# Altium schematic sheet icaRUSv0.2.SchDoc
size A3; SheetNumber: 1; PageSetup: Record=PageOptions|CenterHorizontal=True|CenterVertical=True|PrintScale=0.52|XCorrection=1.00|YCorrection=1.00|PrintKind=1|BorderSize=5000000|LeftOffset=0|BottomOffset=0|Orientation=2|PaperLength=1000|PaperWidth=1000|Scale=100|PaperSource=7|PrintQuality=600|MediaType=1|DitherType=10|PaperKind=A4|PrintScaleMode=1
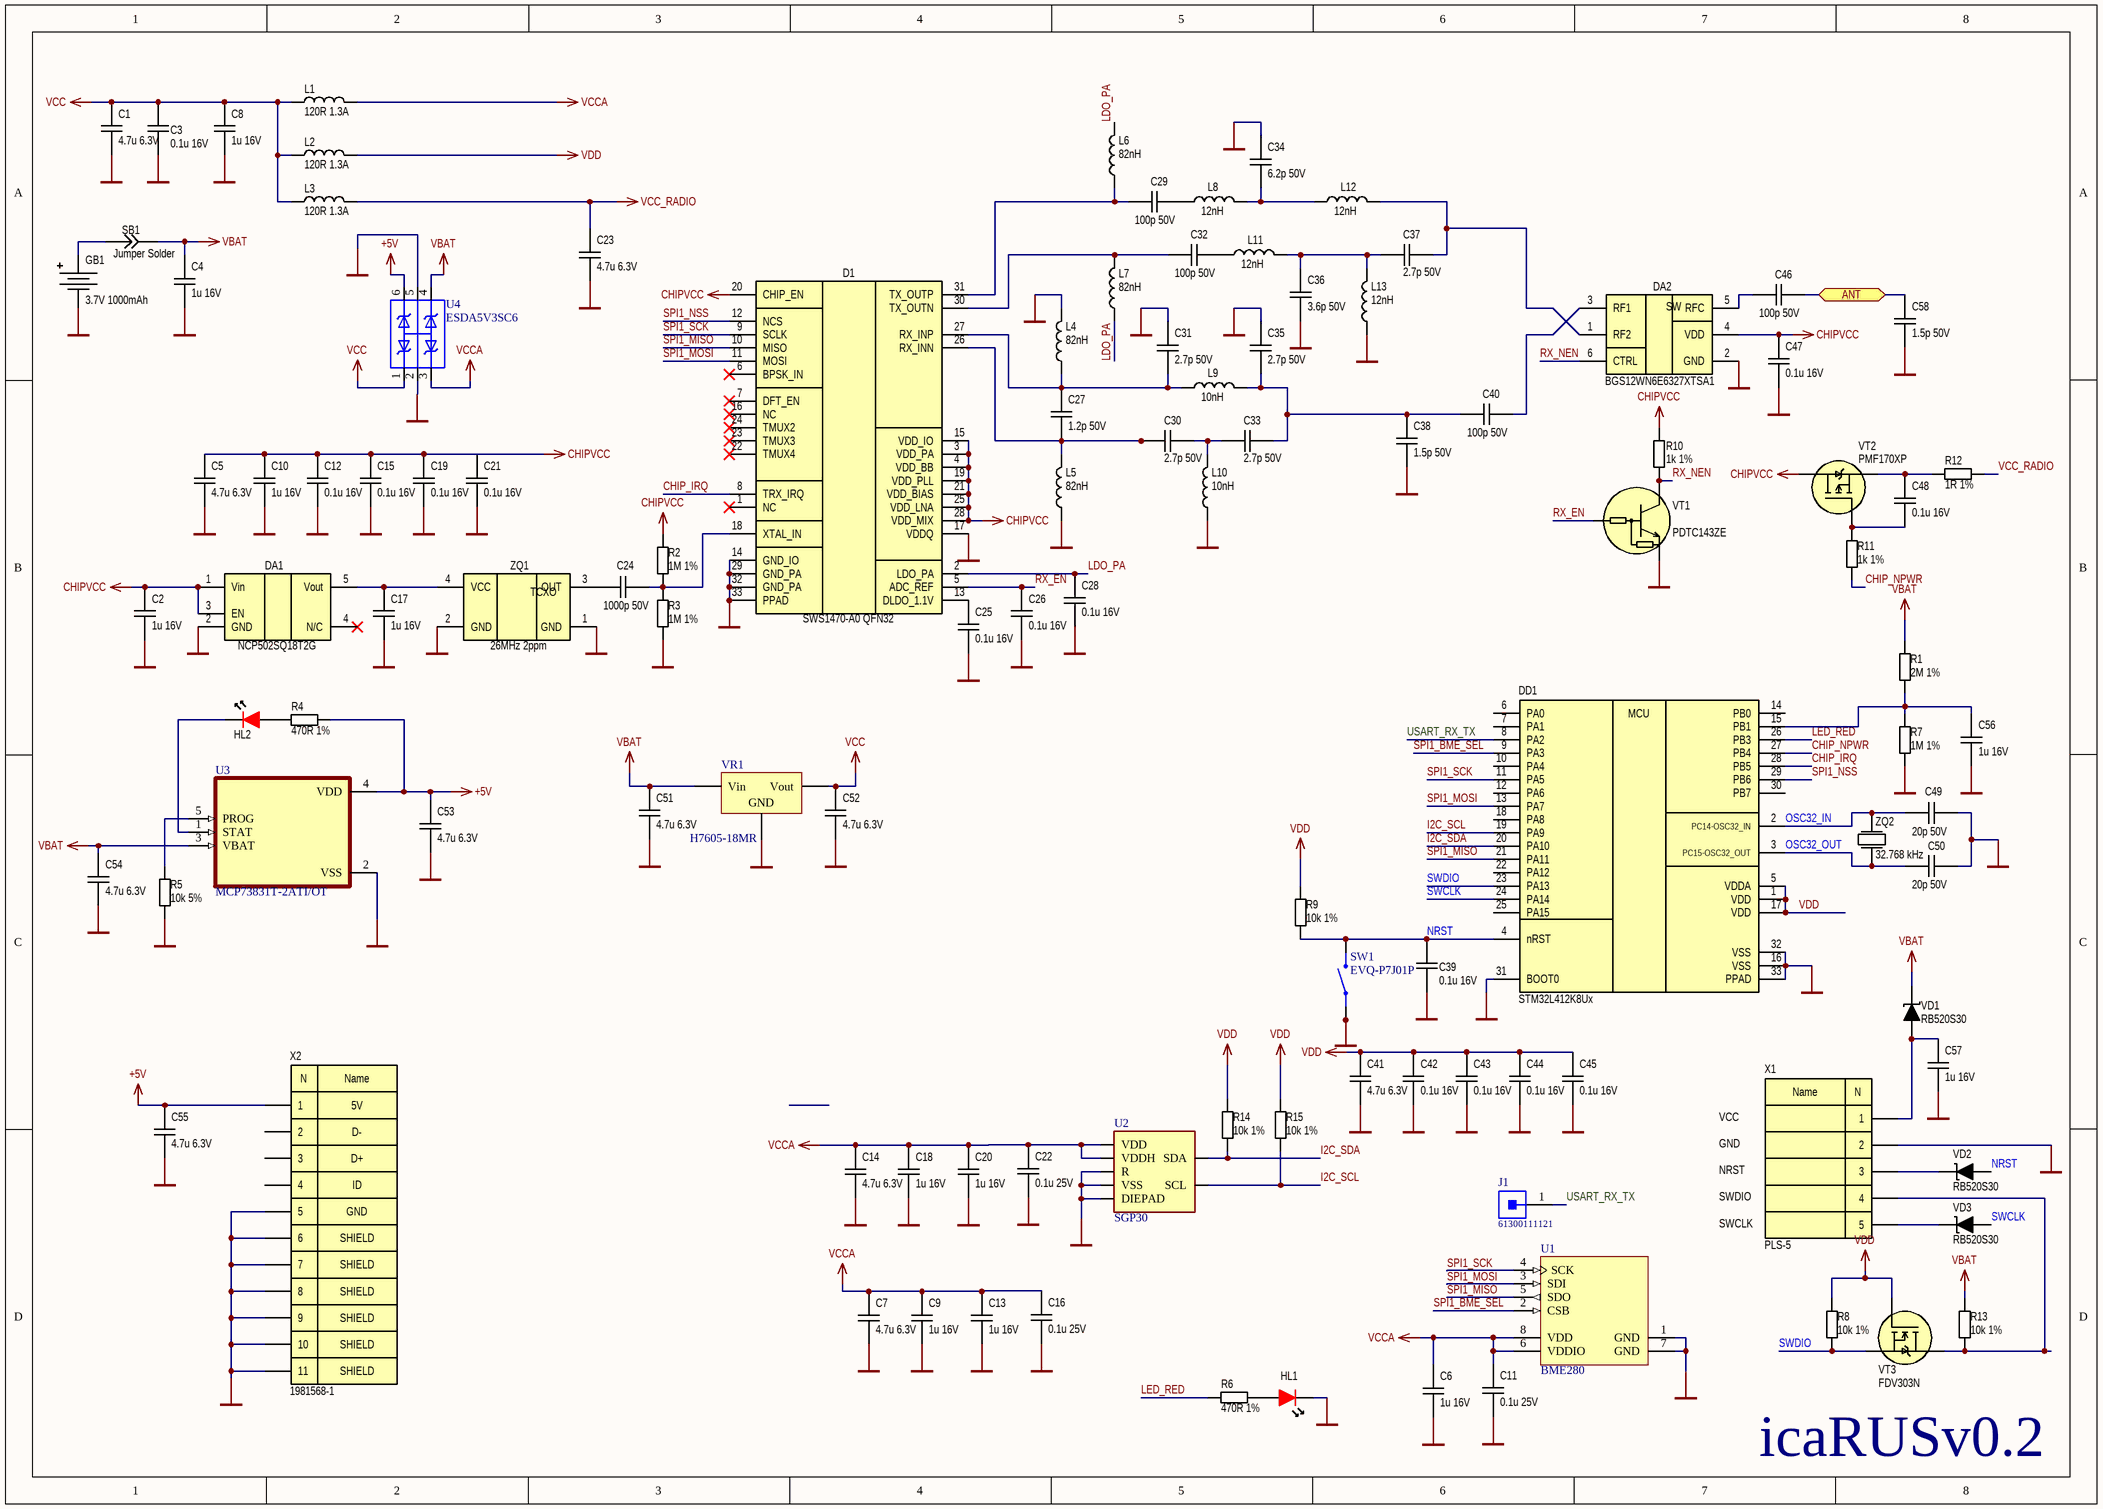
[diagram p0: icaRUSv0.2.SchDoc]

## Parts
C1  4.7u 6.3V  [C0402]
C2  1u 16V  [C0402]
C3  0.1u 16V  [C0402]
C4  1u 16V  [C0402]
C5  4.7u 6.3V  [C0402]
C6  1u 16V  [C0402]
C7  4.7u 6.3V  [C0402]
C8  1u 16V  [C0402]
C9  1u 16V  [C0402]
C10  1u 16V  [C0402]
C11  0.1u 25V  [C0402]
C12  0.1u 16V  [C0402]
C13  1u 16V  [C0402]
C14  4.7u 6.3V  [C0402]
C15  0.1u 16V  [C0402]
C16  0.1u 25V  [C0402]
C17  1u 16V  [C0402]
C18  1u 16V  [C0402]
C19  0.1u 16V  [C0402]
C20  1u 16V  [C0402]
C21  0.1u 16V  [C0402]
C22  0.1u 25V  [C0402]
C23  4.7u 6.3V  [C0402]
C24  1000p 50V  [C0402]
C25  0.1u 16V  [C0402]
C26  0.1u 16V  [C0402]
C27  1.2p 50V  [C0402]
C28  0.1u 16V  [C0402]
C29  100p 50V  [C0402]
C30  2.7p 50V  [C0402]
C31  2.7p 50V  [C0402]
C32  100p 50V  [C0402]
C33  2.7p 50V  [C0402]
C34  6.2p 50V  [C0402]
C35  2.7p 50V  [C0402]
C36  3.6p 50V  [C0402]
C37  2.7p 50V  [C0402]
C38  1.5p 50V  [C0402]
C39  0.1u 16V  [C0402]
C40  100p 50V  [C0402]
C41  4.7u 6.3V  [C0402]
C42  0.1u 16V  [C0402]
C43  0.1u 16V  [C0402]
C44  0.1u 16V  [C0402]
C45  0.1u 16V  [C0402]
C46  100p 50V  [C0402]
C47  0.1u 16V  [C0402]
C48  0.1u 16V  [C0402]
C49  20p 50V  [C0402]
C50  20p 50V  [C0402]
C51  4.7u 6.3V  [C0402]
C52  4.7u 6.3V  [C0402]
C53  4.7u 6.3V  [C0402]
C54  4.7u 6.3V  [C0402]
C55  4.7u 6.3V  [C0402]
C56  1u 16V  [C0402]
C57  1u 16V  [C0402]
C58  1.5p 50V  [C0402]
D1  SWS1470-A0 QFN32  [QFN32]
DA1  NCP502SQ18T2G  [SOT323-5]
DA2  BGS12WN6E6327XTSA1  [6-XFDFN]
DD1  STM32L412K8Ux  [UFQFPN32]
GB1  3.7V 1000mAh  [LP753440 3.7V 1000mAh with PCM]
HL1  RED  [LED0603_RED]  (value not drawn)
HL2  RED  [LED0603_RED]  (value not drawn)
J1  61300111121  [61300111121]
L1  120R 1.3A  [L0402_BEAD]
L2  120R 1.3A  [L0402_BEAD]
L3  120R 1.3A  [L0402_BEAD]
L4  82nH  [L0402]
L5  82nH  [L0402]
L6  82nH  [L0402]
L7  82nH  [L0402]
L8  12nH  [L0402]
L9  10nH  [L0402]
L10  10nH  [L0402]
L11  12nH  [L0402]
L12  12nH  [L0402]
L13  12nH  [L0402]
R1  2M 1%  [R0402]
R2  1M 1%  [R0402]
R3  1M 1%  [R0402]
R4  470R 1%  [R0402]
R5  10k 5%  [R0402]
R6  470R 1%  [R0402]
R7  1M 1%  [R0402]
R8  10k 1%  [R0402]
R9  10k 1%  [R0402]
R10  1k 1%  [R0402]
R11  1k 1%  [R0402]
R12  1R 1%  [R0402]
R13  10k 1%  [R0402]
R14  10k 1%  [R0402]
R15  10k 1%  [R0402]
SB1  Jumper Solder  [SB0805]
SW1  EVQ-P7J01P  [SW_EVQ-P7J01P]
U1  BME280  [BOSC-BME280-8_V]
U2  SGP30  [SGP30]
U3  MCP73831T-2ATI/OT  [SOT23-5]
U4  ESDA5V3SC6  [SOT23-6L]
VD1  RB520S30  [SOD523F]
VD2  RB520S30  [SOD523F]
VD3  RB520S30  [SOD523F]
VR1  H7605-18MR  [SOT23-3L]
VT1  PDTC143ZE  [SOT416]
VT2  PMF170XP  [SOT323]
VT3  FDV303N  [SOT23-3L]
X1  PLS-5  [PLS-5-2.54-PCB]
X2  1981568-1  [1981568-1]
ZQ1  26MHz 2ppm  [QSMD2.0x1.6x0.7]
ZQ2  32.768 kHz  [QSMD3.2X1.5X0.8]

## Ports
ANT (bidir)

## Nets
+5V: C53.1 C55.1 R4.1 U3.4(VDD) U4.6(K4) X2.1
CHIPVCC: C2.2 C5.1 C10.2 C12.2 C15.2 C19.2 C21.2 C47.2 D1.3(VDD_PA) D1.4(VDD_BB) D1.15(VDD_IO) D1.19(VDD_PLL) D1.20(CHIP_EN) D1.21(VDD_BIAS) D1.25(VDD_LNA) D1.28(VDD_MIX) DA1.1(Vin) DA1.3(EN) DA2.4(VDD) R2.2 R10.2 VT2.3(D)
GND: C1.2 C2.1 C3.1 C4.1 C5.2 C6.1 C7.2 C8.1 C9.1 C10.1 C11.2 C12.1 C13.1 C14.2 C15.1 C16.2 C17.1 C18.1 C19.1 C20.1 C21.1 C22.2 C23.1 C25.1 C26.1 C28.1 C31.1 C34.1 C35.1 C36.2 C38.2 C39.2 C41.2 C42.2 C43.2 C44.2 C45.2 C47.1 C49.2 C50.2 C51.2 C52.2 C53.2 C54.2 C55.2 C56.1 C57.1 C58.2 D1.14(GND_IO) D1.17(VDDQ) D1.29(GND_PA) D1.32(GND_PA) D1.33(PPAD) DA1.2(GND) DA2.2(GND) DD1.16(VSS) DD1.31(BOOT0) DD1.32(VSS) DD1.33(PPAD) GB1.2 HL1.2 L4.2 L5.1 L10.1 L13.1 R3.1 R5.2 R7.1 SW1.1_1 SW1.1_2 U1.1(GND) U1.7(GND) U2.2(VSS) U2.4(R) U2.DIEPAD U3.2(VSS) U4.2(A1) U4.5(A2) VR1.2(GND) VT1.2 X1.2 X2.5 X2.6 X2.7 X2.8 X2.9 X2.10 X2.11 ZQ1.1(GND) ZQ1.2(GND)
VBAT: C4.2 C51.1 C54.1 R1.2 R13.2 SB1.2 U3.3(VBAT) U4.4(K3) VD1.2 VR1.1(Vin)
VCC: C1.1 C3.2 C8.2 C52.1 L1.1 L2.1 L3.1 U4.1(K1) VR1.3(Vout)
VCC_RADIO: C23.2 L3.2 R12.1
VCCA: C6.2 C7.1 C9.2 C11.1 C13.2 C14.1 C16.1 C18.2 C20.2 C22.1 L1.2 U1.6(VDDIO) U1.8(VDD) U2.1(VDD) U2.5(VDDH) U4.3(K2)
VDD: C41.1 C42.1 C43.1 C44.1 C45.1 DD1.1(VDD) DD1.5(VDDA) DD1.17(VDD) L2.2 R8.2 R9.1 R14.1 R15.1 VT3.1(G)
ANT: C46.2 C58.1 ; port ANT
CHIP_IRQ: D1.8(TRX_IRQ) DD1.28(PB5)
CHIP_NPWR: DD1.27(PB4) R11.1
I2C_SCL: DD1.19(PA9) R15.2 U2.6(SCL)
I2C_SDA: DD1.20(PA10) R14.2 U2.3(SDA)
LDO_PA: C28.2 D1.2(LDO_PA) L6.2 L7.1
LED_RED: DD1.26(PB3) R6.2
NRST: C39.1 DD1.4(nRST) R9.2 SW1.2_1 SW1.2_2 VD2.1
OSC32_IN: C49.1 DD1.2(PC14-OSC32_IN) ZQ2.1
OSC32_OUT: C50.1 DD1.3(PC15-OSC32_OUT) ZQ2.3
RX_EN: C26.2 D1.5(ADC_REF) VT1.1
RX_NEN: DA2.6(CTRL) R10.1 VT1.3
SPI1_BME_SEL: DD1.9(PA3) U1.2(CSB)
SPI1_MISO: D1.10(MISO) DD1.21(PA11) U1.5(SDO)
SPI1_MOSI: D1.11(MOSI) DD1.13(PA7) U1.3(SDI)
SPI1_NSS: D1.12(NCS) DD1.29(PB6)
SPI1_SCK: D1.9(SCLK) DD1.11(PA5) U1.4(SCK)
SWCLK: DD1.24(PA14) VD3.1
SWDIO: DD1.23(PA13) R8.1 VT3.2(S)
USART_RX_TX: DD1.8(PA2) J1.1
NetC17_2: C17.2 DA1.5(Vout) ZQ1.4(VCC)
NetC24_1: C24.1 ZQ1.3(OUT)
NetC24_2: C24.2 D1.18(XTAL_IN) R2.1 R3.2
NetC25_2: C25.2 D1.13(DLDO_1.1V)
NetC27_1: C27.1 C31.2 D1.27(RX_INP) L4.1 L9.1
NetC27_2: C27.2 C30.1 D1.26(RX_INN) L5.2
NetC29_1: C29.1 D1.31(TX_OUTP) L6.1
NetC29_2: C29.2 L8.1
NetC30_2: C30.2 C33.1 L10.2
NetC32_1: C32.1 D1.30(TX_OUTN) L7.2
NetC32_2: C32.2 L11.1
NetC33_2: C33.2 C35.2 C38.1 C40.1 L9.2
NetC34_2: C34.2 L8.2 L12.1
NetC36_1: C36.1 C37.1 L11.2 L13.2
NetC37_2: C37.2 DA2.1(RF2) L12.2
NetC40_2: C40.2 DA2.3(RF1)
NetC46_1: C46.1 DA2.5(RFC)
NetC48_1: C48.1 R11.2 VT2.1(G)
NetC48_2: C48.2 R12.2 VT2.2(S)
NetC56_2: C56.2 DD1.15(PB1) R1.1 R7.2
NetC57_2: C57.2 VD1.1 X1.1
NetGB1_1: GB1.1 SB1.1
NetHL1_1: HL1.1 R6.1
NetHL2_1: HL2.1 R4.2
NetHL2_2: HL2.2 U3.1(STAT)
NetR5_1: R5.1 U3.5(PROG)
NetR13_1: R13.1 VT3.3(D) X1.4
NetVD2_2: VD2.2 X1.3
NetVD3_2: VD3.2 X1.5

Not connected (* = marked no-connect by the designer): D1 1(NC)* 6(BPSK_IN)* 7(DFT_EN)* 16(NC)* 22(TMUX4)* 23(TMUX3)* 24(TMUX2)*; DA1 4(N/C)*; DD1 6(PA0) 7(PA1) 10(PA4) 12(PA6) 14(PB0) 18(PA8) 22(PA12) 25(PA15) 30(PB7); X2 2 3 4

## Notes on the sheet
- VCC
- GND
- NRST
- SWCLK
- SWDIO
- icaRUSv0.2
- (in symbol 1981568-1) N; Name; 5V; D-; D+; ID; GND; SHIELD
- (in symbol BGS12WN6E6327XTSA1) SW
- (in symbol NT2016SA-26.000000MHZ-NBG2) TCXO
- (in symbol PLS-5) Name; N
- (in symbol STM32L412K8Ux) MCU

## Library data of the parts
C1 C5 C7 C14 C23 C41 C51-C55 = CC0402KRX5R5BB475: CAP CER 4.7UF 6.3V X5R 0402; PartNumber: CC0402KRX5R5BB475
C2 C17 = CC0402KRX5R7BB105: CAP CER 1UF 16V X5R 0402; PartNumber: CC0402KRX5R7BB105
C3 = CC0603KRX7R7BB104: CERCAP 0.1/16V 0402 KX7R; PartNumber: CC0402KRX7R7BB104
C4 C8 = CC0603KRX7R7BB105: CAP CER 1UF 16V X5R 0402; PartNumber: CC0402KRX5R7BB105
C6 C9 C10 C13 C18 C20 C56 C57 = CC0402KRX7R8BB104: CAP CER 1UF 16V X5R 0402; PartNumber: CC0402KRX5R7BB105
C11 C16 C22 = CC0402KRX7R8BB104: CAP CER 0.1UF 25V X7R 0402; PartNumber: CC0402KRX7R8BB104
C12 C15 C19 C21 C25 C26 C28 C39 C42-C45 C47 C48 = CC0402KRX7R8BB104: CERCAP 0.1/16V 0402 KX7R; PartNumber: CC0402KRX7R7BB104
C24 = CC0402JRX7R9BB102: CAP CER 1000PF 1% 50V C0G/NPO 0402; PartNumber: 0402N102F500LT
C27 = CC0402BRNPO9BN1R0: CAP CER 1.2PF 50V NPO 0402; PartNumber: CC0402BRNPO9BN1R2
C29 C32 C40 C46 = CC0402JRNPO9BN101: CAP CER 100PF 50V C0G/NPO 0402; PartNumber: CC0402JRNPO9BN101
C30 C31 C33 C35 = CC0402BRNPO9BN2R0: CAP CER 2.7PF 50V C0G/NPO 0402; PartNumber: CC0402BRNPO9BN2R7
C34 = CC0402CRNPO9BN6R2: CAP CER 6.2PF 50V NPO 0402; PartNumber: CC0402CRNPO9BN6R2
C36 = CC0402BRNPO9BN3R6: CAP CER 3.6PF 50V NPO 0402; PartNumber: CC0402BRNPO9BN3R6
C37 = CC0402BRNPO9BN3R6: CAP CER 2.7pF 50V NPO 0402; PartNumber: CC0402BRNPO9BN2R7
C38 C58 = CC0402BRNPO9BN1R0: CAP CER 1.5PF 50V NPO 0402; PartNumber: CC0402BRNPO9BN1R5
C49 C50 = CC0402JRNPO9BN200: CAP CER 20PF 50V C0G/NPO 0402; PartNumber: CC0402JRNPO9BN200
D1 = SWS1470-A0 QFN32: Waviot NB-Fi RF Transceiver QFN32; PartNumber: SWS1470-A0 QFN32
DA1 = NCP502SQ18T2G: IC REG LINEAR 1.8V 80MA SC88A; PartNumber: NCP502SQ18T2G
DA2 = BGS12WN6E6327XTSA1: RF Switch IC WLAN SPDT 50Ohm PG-TSNP-6-10; PartNumber: BGS12WN6E6327XTSA1
DD1 = STM32L412K8Ux: ARM® Cortex®-M4 CPU with FPU, STM32L4 Microcontroller IC 32-Bit 80MHz 64KB (64K x 8) FLASH 32-UFQFPN (5x5); PartNumber: STM32L412KBUx
GB1 = CR17505: LiPoly Battery LP753440 3.7V 1000mAh with PCM; PartNumber: LP753440
HL1 HL2 = FYLS-0603URC: LED Red 0603; PartNumber: FYLS-0603URC
J1 = CMP-1502-01058-1: THT Vertical Pin Header WR-PHD, Pitch 2.54 mm, Single Row, 1 pins; Manufacturer: Wurth Elektronik; Gender: Male; Working Voltage: 250VAC; Withstanding Voltage: 500VAC; Pin Number: 1; Contact Resistance: 20mOhm; Rated Current: 3A; Pitch: 2.54mm; Mounting Technology: THT; Datasheet URL: https://katalog.we-online.de/em/datasheet/6130xx11121.pdf; Manufacturer URL: http://www.we-online.de; Operating Temperature: -40to105degC; Publisher: WurthElektronik; Part Number: 61300111121; Row Number: Single; Package Reference: 61300111121; Orientation: Vertical; Packaging: Bag
L1-L3 = BLM15PD121SZ1D: FERRITE BEAD 120 OHM 0402 1LN; PartNumber: BLM15PD121SZ1D
L4-L7 = LQW15AN82NG00D: FIXED IND 82NH 130MA 2.24 OHM; PartNumber: LQW15AN82NG00D
L8 L11-L13 = LQW15AN12NG00D: FIXED IND 12NH 500MA 140 MOHM; PartNumber: LQW15AN12NG00D
L9 L10 = LQW15AN10NG00D: FIXED IND 10NH 500MA 170 MOHM; PartNumber: LQW15AN10NG00D
R1 = RC0402FR-071ML: RES SMD 2M OHM 1% 1/16W 0402; PartNumber: RC0402FR-072ML
R2 R3 R7 = RC0402FR-071ML: RES SMD 1M OHM 1% 1/16W 0402; PartNumber: RC0402FR-071ML
R4 R6 = RC0603FR-07200RL: RES 0603 470R 1%; PartNumber: RC0603FR-07470RL
R5 = RC0402FR-071ML: RES SMD 10k OHM 5% 1/16W 0402; PartNumber: RC0402JR-0710KL
R8 R9 R13-R15 = RC0402FR-0710KL: RES SMD 10K OHM 1% 1/16W 0402; PartNumber: RC0402FR-0710KL
R10 R11 = RC0402FR-071KL: RES SMD 1K OHM 1% 1/16W 0402; PartNumber: RC0402FR-071KL
R12 = RC0402FR-071RL: RES SMD 1 OHM 1% 1/16W 0402; PartNumber: RC0402FR-071RL
SW1 = EVQ-P7J01P: Tactile Switch SPST-NO Side Actuated Surface Mount, Right Angle; MF: Panasonic Electronic; Package: None; Value: *; Price: None; MP: EVQ-P7J01P; SnapEDA_Link: https://www.snapeda.com/parts/EVQ-P7J01P/Panasonic%20Electronic%20Components/view-part/523087/?ref=snap; Availability: Unavailable
U1 = CMP-2000-05073-1: Combined Humidity and Pressure Sensor, 1.71 to 3.6 V, -40 to 85 degC, 8-Pin SMD, RoHS, Tape and Reel; Manufacturer: Bosch Sensortec; Datasheet Version: Rev. 1.2, 10/2015; Datasheet URL: http://datasheet.octopart.com/BME280-Bosch-datasheet-58577763.pdf; Manufacturer URL: http://www.bosch-sensortec.com
U2 = SGP30: The SGP30 is a digital multi-pixel gas sensor designed for easy integration into air purifier, demand-controlled ventilation, and IoT applications.; MF: {'manufacturer': u'Sensirion AG'}; Package: None; MP: SGP30; Availability: Unavailable; Price: None; Value: *
U3 = MCP73831T-2ATI/OT: Charger IC Lithium Ion/Polymer SOT-23-5; MF: Microchip; Availability: Unavailable; SnapEDA_Link: https://www.snapeda.com/parts/MCP73831T-2ATI/OT/Microchip/view-part/51423/?ref=snap; Price: None; MP: MCP73831T-2ATI/OT; Arrow_Americas-Purchase-URL: https://snapeda.com/shop?store=Arrow+Americas&id=51423; Package: SOT-23 Microchip; DigiKey-Purchase-URL: https://snapeda.com/shop?store=DigiKey&id=51423; Value: *; Mouser-Purchase-URL: https://snapeda.com/shop?store=Mouser&id=51423
U4 = ESDA5V3SC6: Clamp Ipp Tvs Diode Surface Mount SOT-23-6; MF: STMicroelectronics; SnapEDA_Link: https://www.snapeda.com/parts/ESDA5V3SC6/STMicroelectronics/view-part/385392/?ref=snap; Availability: Unavailable; Price: None; MP: ESDA5V3SC6; Package: SOT-23-6 STMicroelectronics; Value: *
VD1-VD3 = RB520S30: RECTIFIER DIODE, SCHOTTKY, 0.2A; PartNumber: RB520S30
VR1 = Volt Reg: Voltage Regulator H7605-18MR; PartNumber: H7605-18MR
VT1 = PDTC143ZE: SMALL SIGNAL BIPOLAR TRANSISTOR; PartNumber: PDTC143ZE
VT2 = PMF170XP: MOSFET P-CH 20V 1A SOT323; PartNumber: PMF170XP
VT3 = FDV303N: MOSFET N-CH 25V 680MA SOT-23; PartNumber: FDV303N
X1 = PLS-5: PLS-5-2.54; PartNumber: PLS-5
X2 = 1981568-1: CONN RCPT USB2.0 MICRO B SMD R/A; PartNumber: 1981568-1
ZQ1 = NT2016SA-26.000000MHZ-NBG2: TCXO Oscillator 4-pin; PartNumber: NT2016SA-26.000000MHZ-NBG2
ZQ2 = NX3215SA-32.768K-EXS00A: CRYSTAL 32.768KHZ 12.5PF SMD; PartNumber: NX3215SA-32.768K-EXS00A
SB1 = Jumper Solder: Value: *